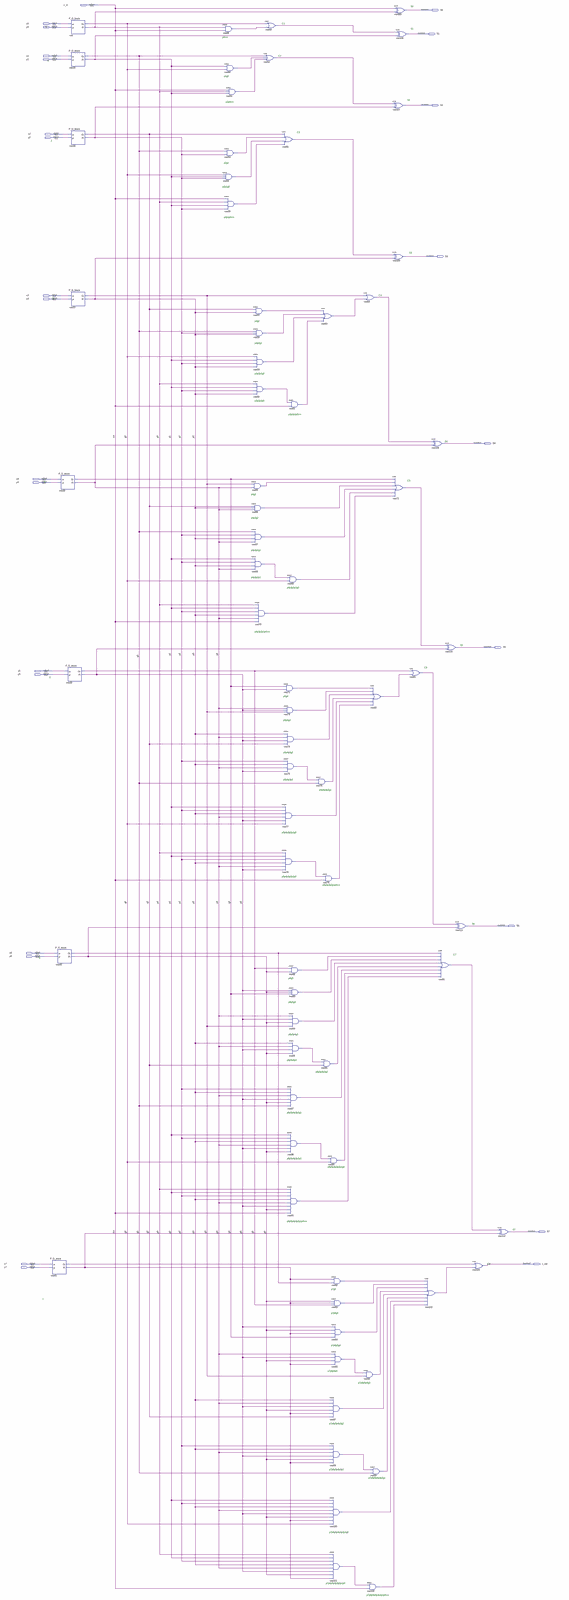
[diagram p0: schematic sheet, whole]
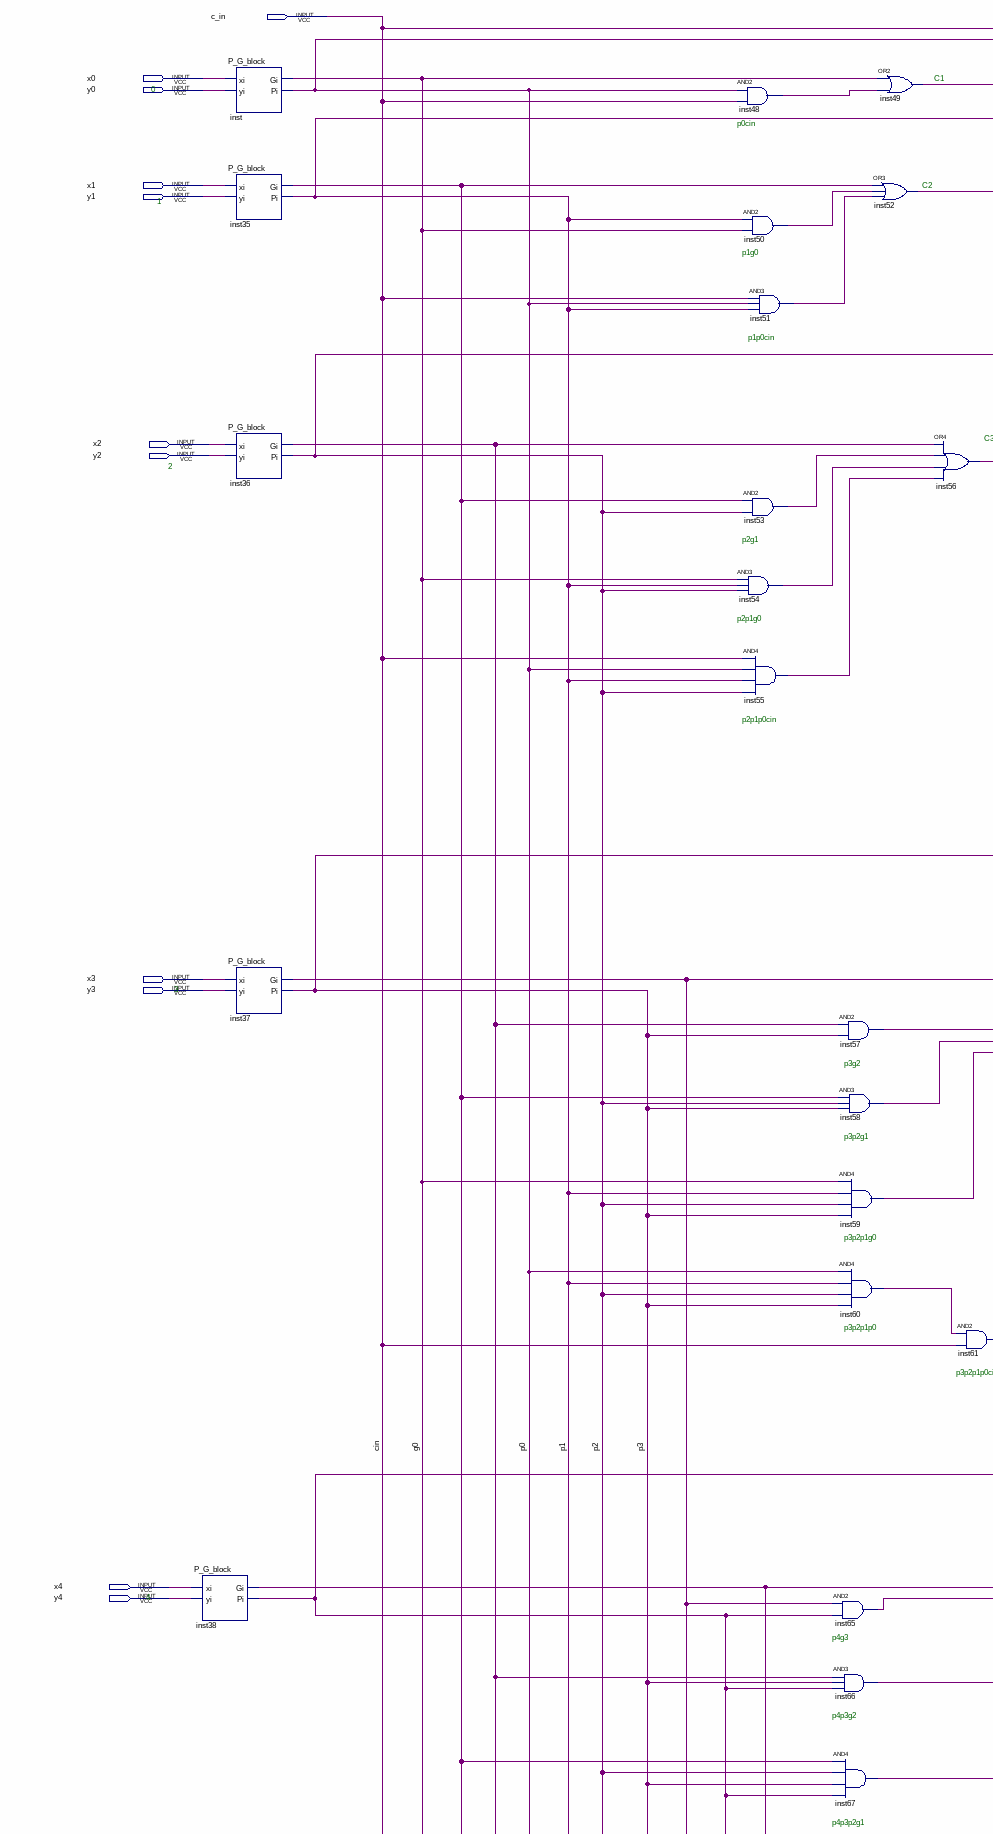
[diagram p1: schematic sheet, upper left part]
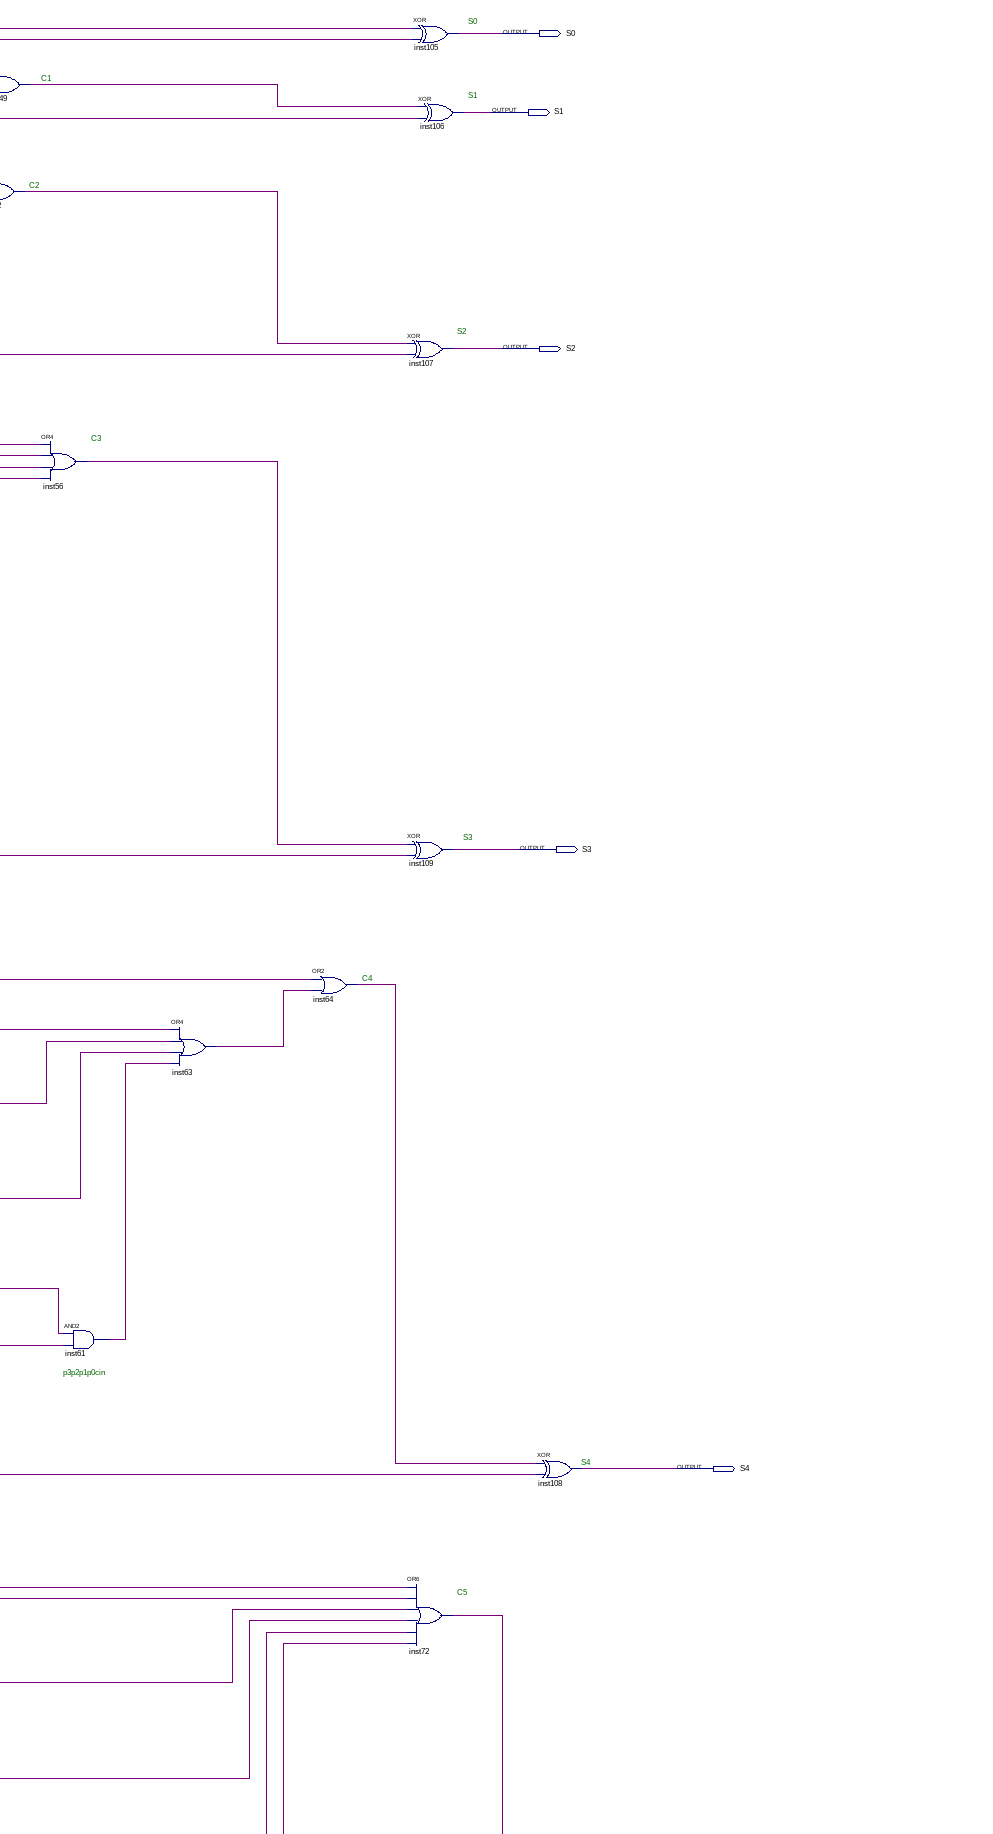
[diagram p2: schematic sheet, upper right part]
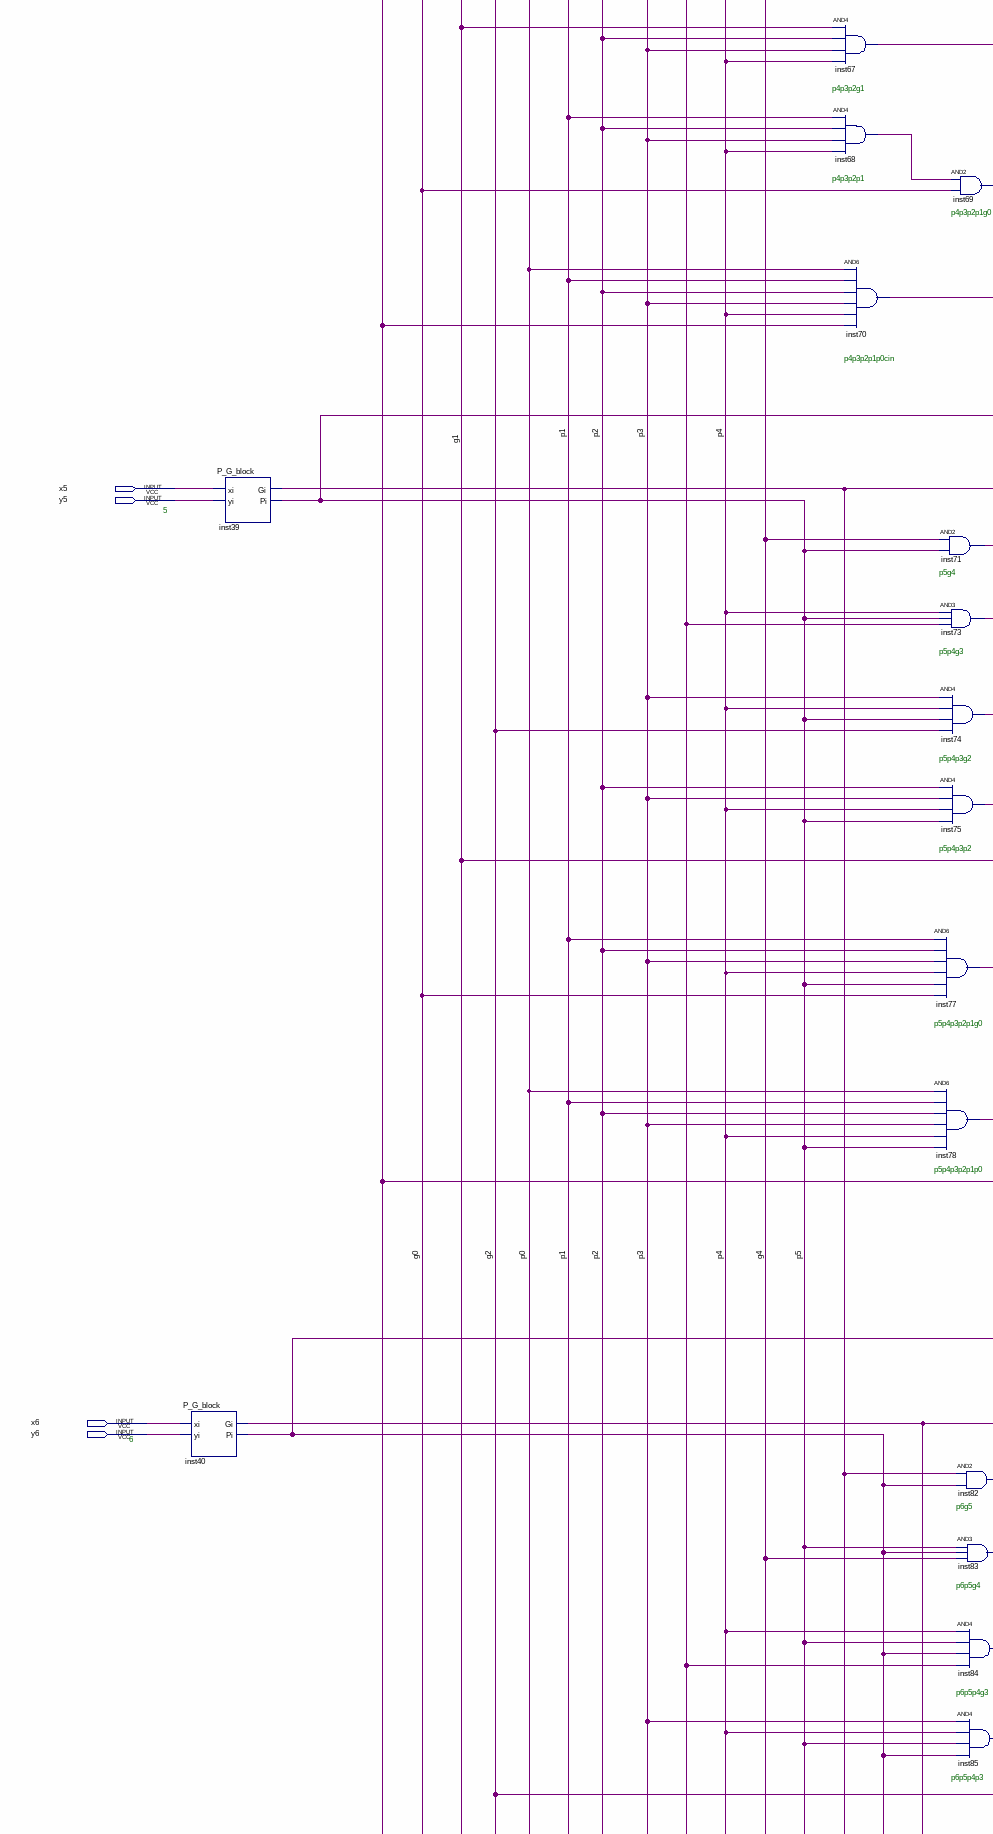
[diagram p3: schematic sheet, middle left part]
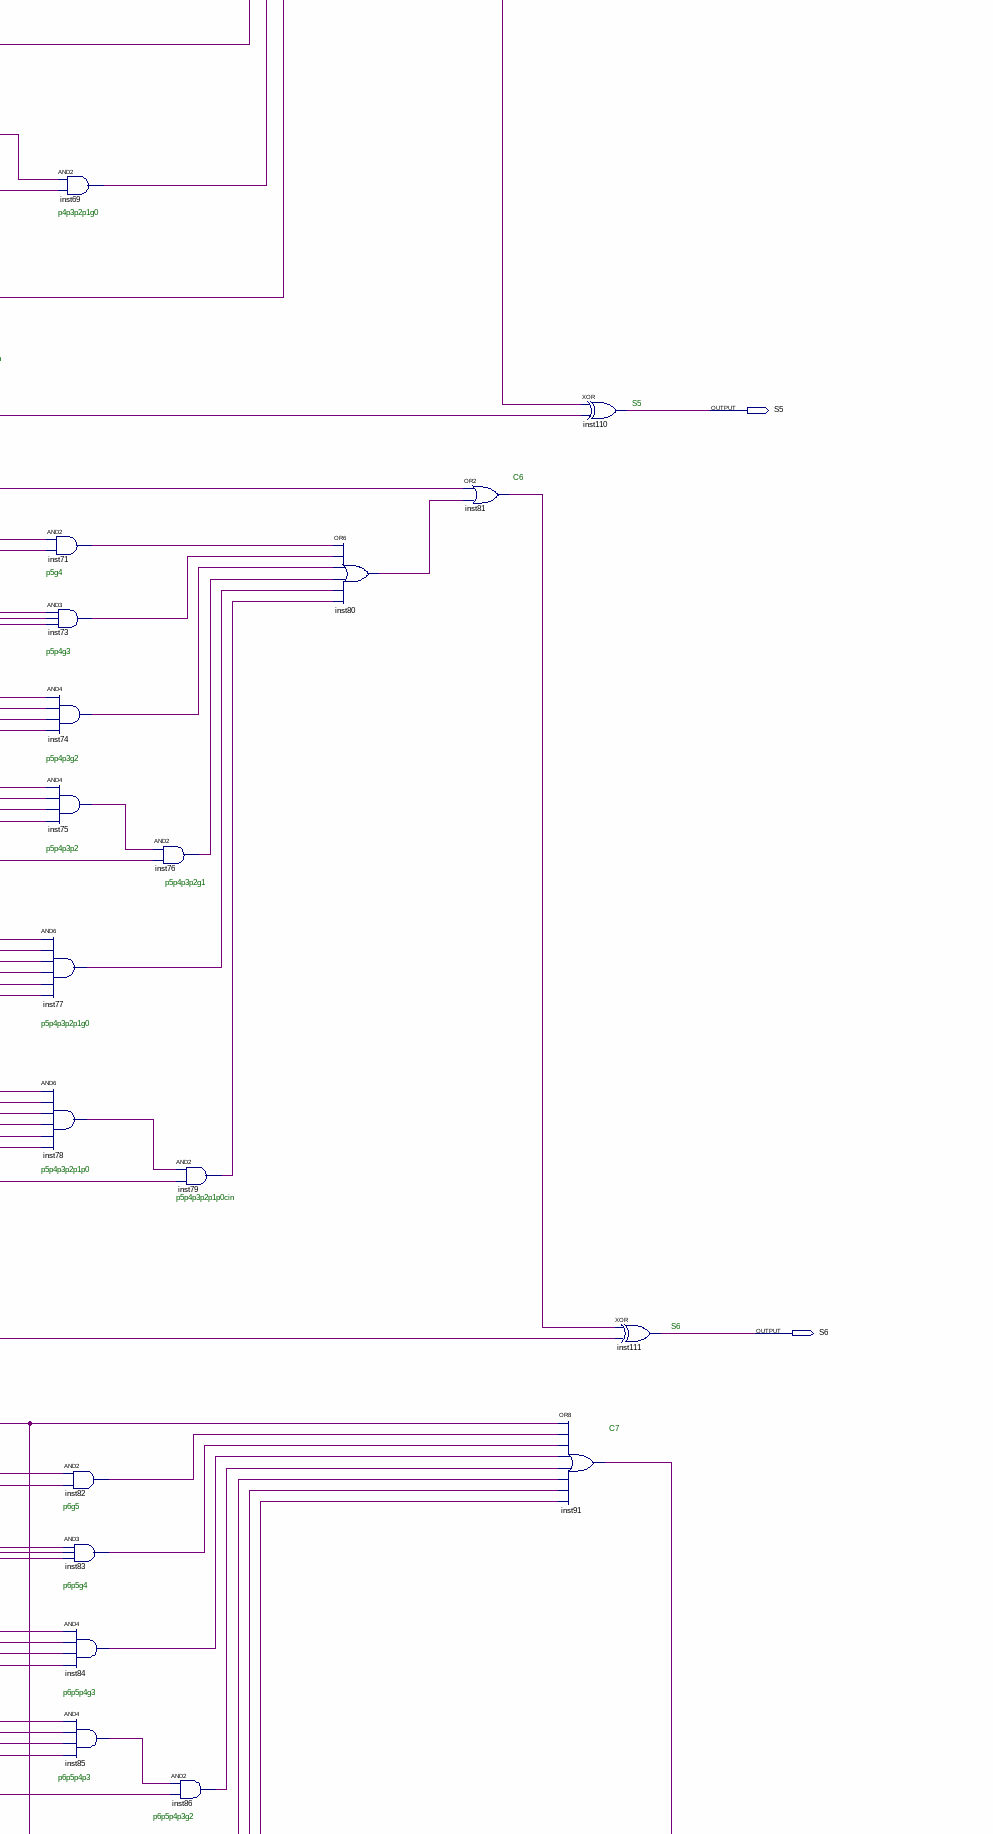
[diagram p4: schematic sheet, middle right part]
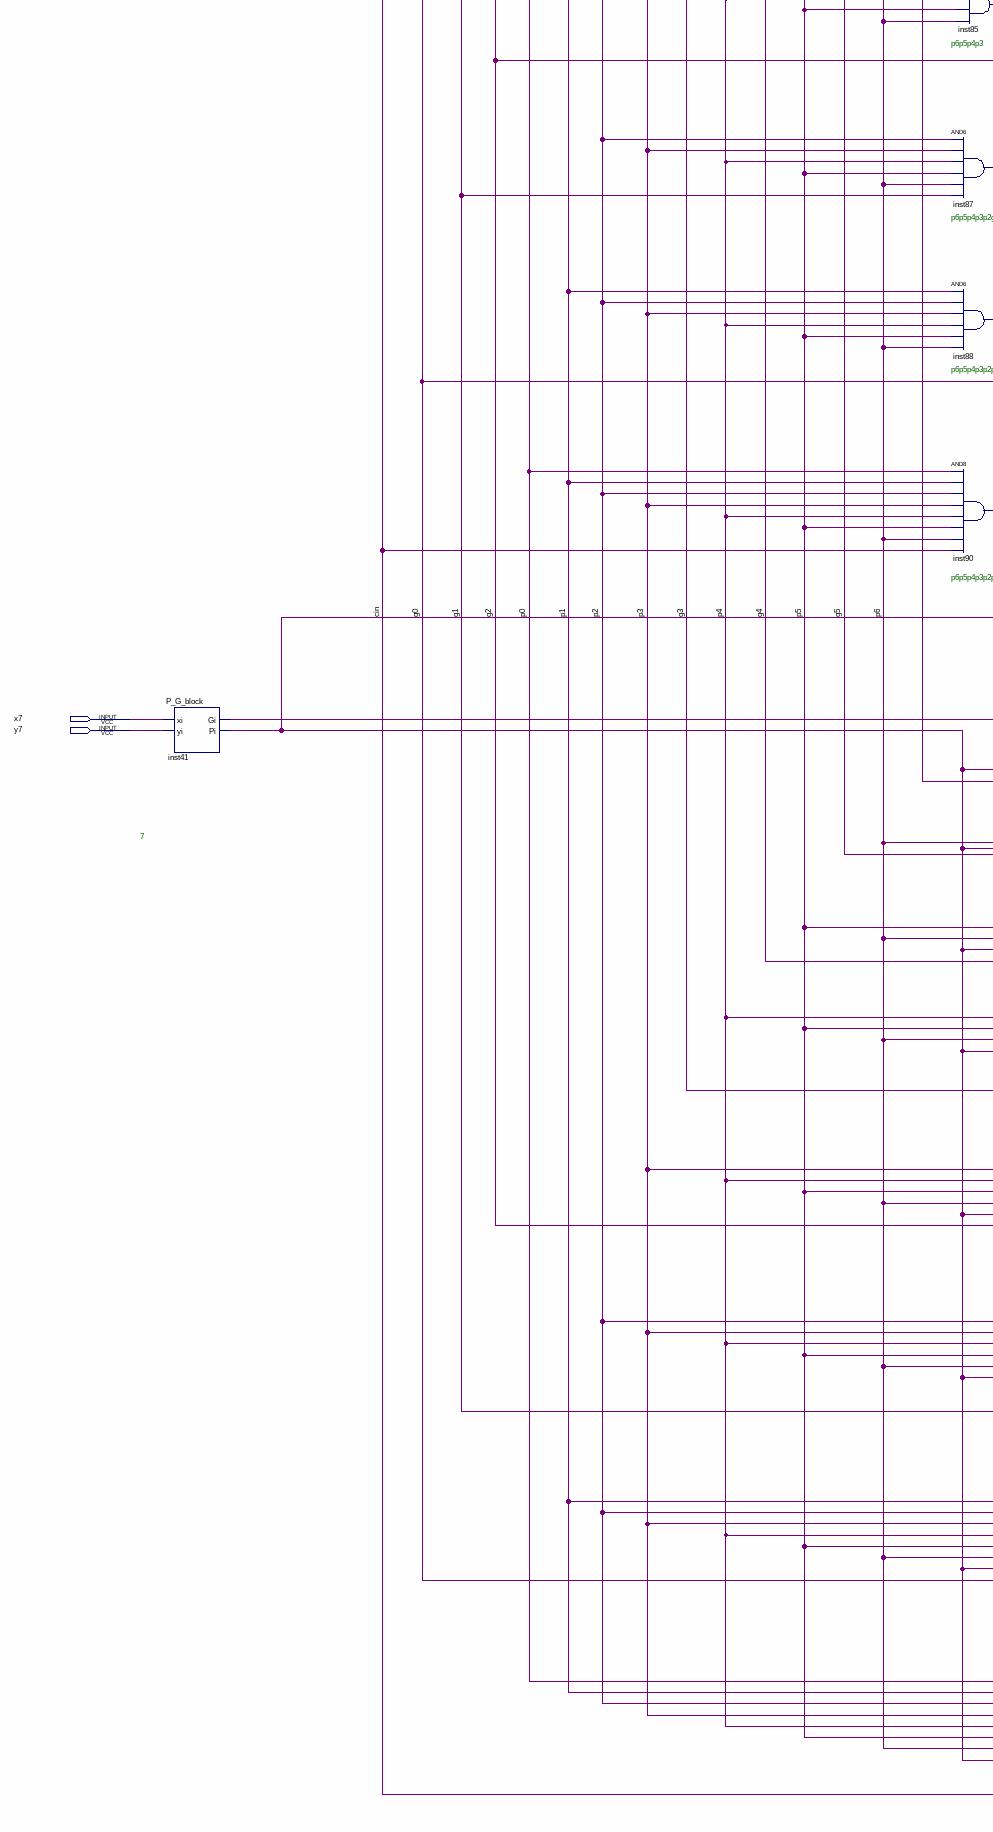
[diagram p5: schematic sheet, lower left part]
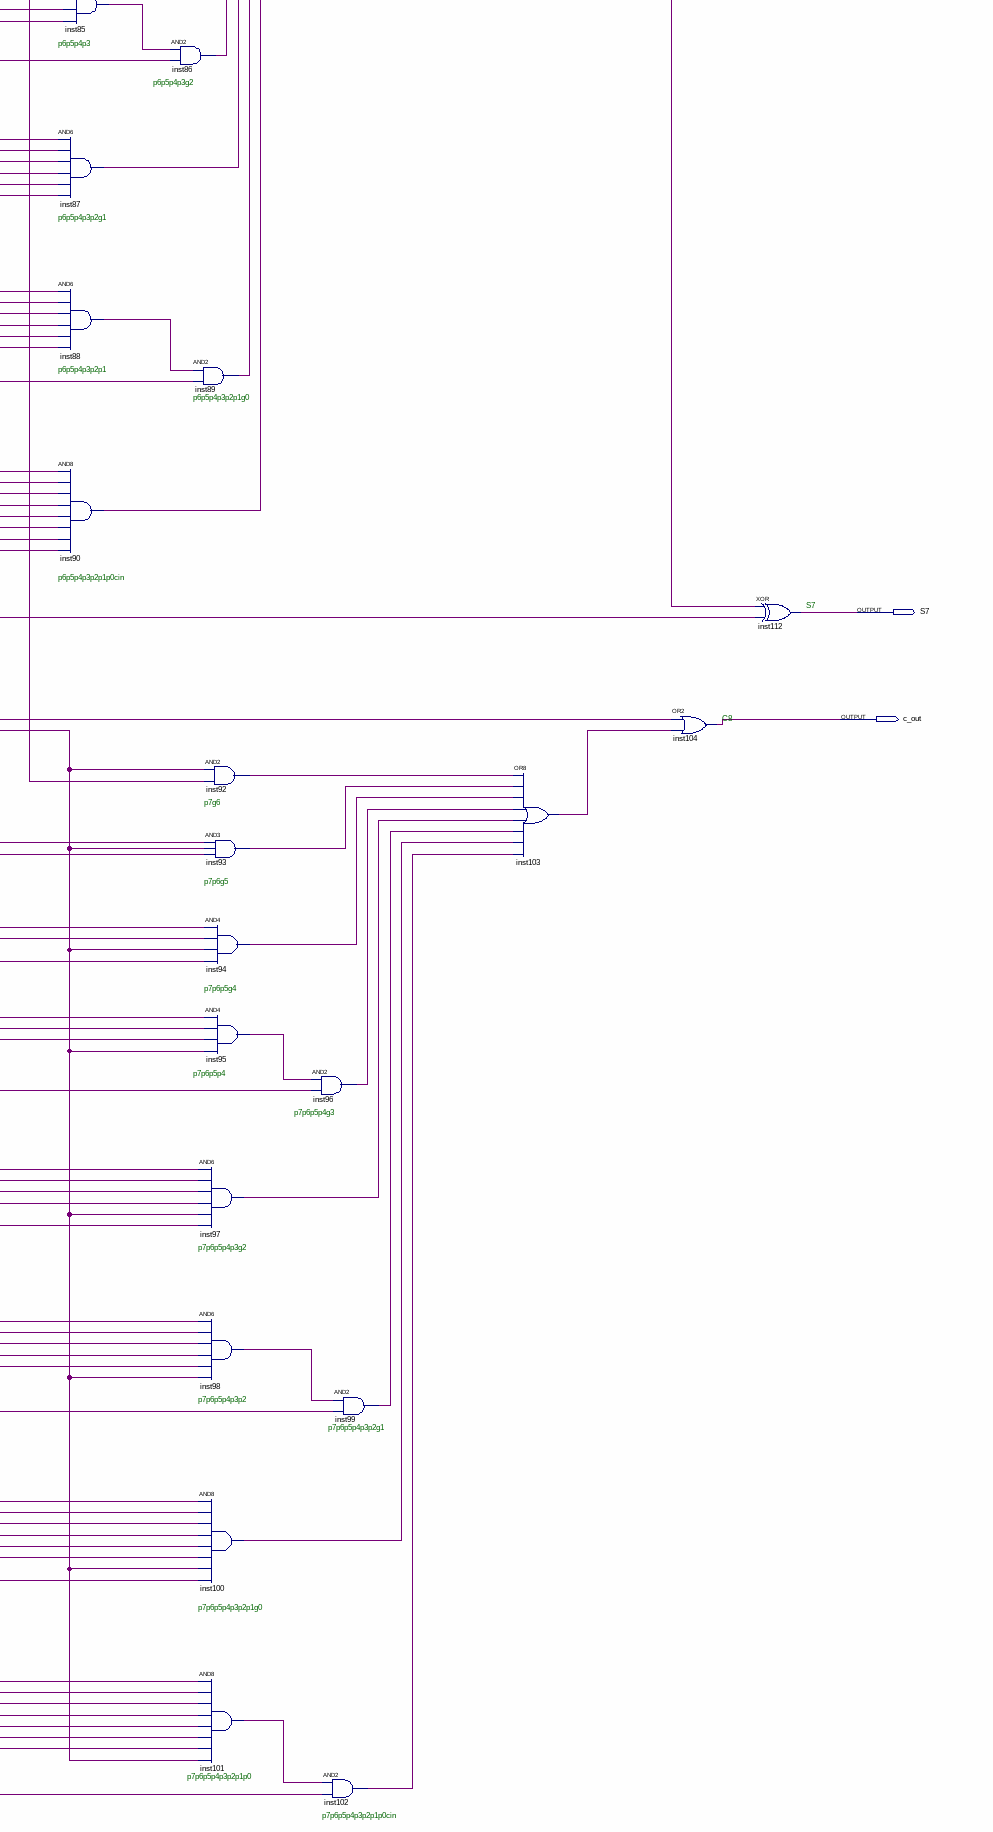
[diagram p6: schematic sheet, lower right part]
// Quartus schematic CLA_8inputs_updated.bdf as structural Verilog: 72 symbols, 26 pins
module CLA_8inputs_updated (
  input  c_in,
  input  x0,
  input  y0,
  input  x1,
  input  y1,
  input  x2,
  input  y2,
  input  x3,
  input  y3,
  input  x4,
  input  y4,
  input  x5,
  input  y5,
  input  x6,
  input  y6,
  input  x7,
  input  y7,
  output S0,
  output S1,
  output S2,
  output S3,
  output S4,
  output S5,
  output S6,
  output S7,
  output c_out
);

  wire g0, g1, g2, g3, g4, g5, inst40_gi, inst41_gi, inst41_pi, inst48_out, inst49_out, inst50_out,
       inst51_out, inst52_out, inst53_out, inst54_out, inst55_out, inst56_out, inst57_out, inst58_out,
       inst59_out, inst60_out, inst61_out, inst63_out, inst64_out, inst65_out, inst66_out, inst67_out,
       inst68_out, inst69_out, inst70_out, inst71_out, inst72_out, inst73_out, inst74_out, inst75_out,
       inst76_out, inst77_out, inst78_out, inst79_out, inst80_out, inst81_out, inst82_out, inst83_out,
       inst84_out, inst85_out, inst86_out, inst87_out, inst88_out, inst89_out, inst90_out, inst91_out,
       inst92_out, inst93_out, inst94_out, inst95_out, inst96_out, inst97_out, inst98_out, inst99_out,
       inst100_out, inst101_out, inst102_out, inst103_out, p0, p1, p2, p3, p4, p5, p6;

  P_G_block inst40 (.xi(x6), .yi(y6), .Gi(inst40_gi), .Pi(p6));
  P_G_block inst41 (.xi(x7), .yi(y7), .Gi(inst41_gi), .Pi(inst41_pi));
  P_G_block inst (.xi(x0), .yi(y0), .Gi(g0), .Pi(p0));
  P_G_block inst35 (.xi(x1), .yi(y1), .Gi(g1), .Pi(p1));
  P_G_block inst36 (.xi(x2), .yi(y2), .Gi(g2), .Pi(p2));
  P_G_block inst37 (.xi(x3), .yi(y3), .Gi(g3), .Pi(p3));
  P_G_block inst38 (.xi(x4), .yi(y4), .Gi(g4), .Pi(p4));
  P_G_block inst39 (.xi(x5), .yi(y5), .Gi(g5), .Pi(p5));
  and inst48 (inst48_out, p0, c_in);
  and inst50 (inst50_out, p1, g0);
  and inst51 (inst51_out, c_in, p0, p1);
  and inst53 (inst53_out, g1, p2);
  and inst54 (inst54_out, g0, p1, p2);
  and inst55 (inst55_out, c_in, p0, p1, p2);
  and inst57 (inst57_out, g2, p3);
  and inst58 (inst58_out, g1, p2, p3);
  and inst59 (inst59_out, g0, p1, p2, p3);
  and inst60 (inst60_out, p0, p1, p2, p3);
  and inst65 (inst65_out, g3, p4);
  and inst66 (inst66_out, g2, p3, p4);
  and inst67 (inst67_out, g1, p2, p3, p4);
  and inst68 (inst68_out, p1, p2, p3, p4);
  and inst70 (inst70_out, p0, p1, p2, p3, p4, c_in);
  or inst49 (inst49_out, g0, inst48_out);
  or inst52 (inst52_out, g1, inst50_out, inst51_out);
  or inst56 (inst56_out, g2, inst53_out, inst54_out, inst55_out);
  and inst71 (inst71_out, g4, p5);
  and inst73 (inst73_out, p4, p5, g3);
  and inst74 (inst74_out, p3, p4, p5, g2);
  and inst75 (inst75_out, p2, p3, p4, p5);
  and inst77 (inst77_out, p1, p2, p3, p4, p5, g0);
  and inst78 (inst78_out, p0, p1, p2, p3, p4, p5);
  and inst61 (inst61_out, inst60_out, c_in);
  and inst69 (inst69_out, inst68_out, g0);
  and inst82 (inst82_out, g5, p6);
  and inst83 (inst83_out, p5, p6, g4);
  and inst84 (inst84_out, p4, p5, p6, g3);
  and inst85 (inst85_out, p3, p4, p5, p6);
  and inst87 (inst87_out, p2, p3, p4, p5, p6, g1);
  and inst88 (inst88_out, p1, p2, p3, p4, p5, p6);
  and inst90 (inst90_out, p0, p1, p2, p3, p4, p5, p6, c_in);
  or inst63 (inst63_out, inst57_out, inst58_out, inst59_out, inst61_out);
  and inst76 (inst76_out, inst75_out, g1);
  and inst79 (inst79_out, inst78_out, c_in);
  and inst86 (inst86_out, inst85_out, g2);
  and inst89 (inst89_out, inst88_out, g0);
  and inst92 (inst92_out, inst41_pi, inst40_gi);
  and inst93 (inst93_out, p6, inst41_pi, g5);
  and inst94 (inst94_out, p5, p6, inst41_pi, g4);
  and inst95 (inst95_out, p4, p5, p6, inst41_pi);
  and inst97 (inst97_out, p3, p4, p5, p6, inst41_pi, g2);
  and inst98 (inst98_out, p2, p3, p4, p5, p6, inst41_pi);
  and inst100 (inst100_out, p1, p2, p3, p4, p5, p6, inst41_pi, g0);
  and inst101 (inst101_out, p0, p1, p2, p3, p4, p5, p6, inst41_pi);
  or inst64 (inst64_out, g3, inst63_out);
  and inst96 (inst96_out, inst95_out, g3);
  and inst102 (inst102_out, inst101_out, c_in);
  or inst80 (inst80_out, inst71_out, inst73_out, inst74_out, inst76_out, inst77_out, inst79_out);
  and inst99 (inst99_out, inst98_out, g1);
  xor inst105 (S0, c_in, p0);
  xor inst107 (S2, inst52_out, p2);
  xor inst109 (S3, inst56_out, p3);
  or inst72 (inst72_out, g4, inst65_out, inst66_out, inst67_out, inst69_out, inst70_out);
  xor inst106 (S1, inst49_out, p1);
  or inst81 (inst81_out, g5, inst80_out);
  xor inst108 (S4, inst64_out, p4);
  or inst103 (inst103_out, inst92_out, inst93_out, inst94_out, inst96_out, inst97_out, inst99_out, inst100_out, inst102_out);
  xor inst110 (S5, inst72_out, p5);
  or inst91 (inst91_out, inst40_gi, inst82_out, inst83_out, inst84_out, inst86_out, inst87_out, inst89_out, inst90_out);
  xor inst111 (S6, inst81_out, p6);
  or inst104 (c_out, inst41_gi, inst103_out);
  xor inst112 (S7, inst91_out, inst41_pi);

  // Other names for the same wires on the sheet: cin = c_in

  // Notes on the sheet:
  //   S0
  //   C1
  //   0
  //   S1
  //   p0cin
  //   C2
  //   1
  //   p1g0
  //   S2
  //   p1p0cin
  //   C3
  //   2
  //   p2g1
  //   p2p1g0
  //   p2p1p0cin
  //   S3
  //   C4
  //   3
  //   p3g2
  //   p3p2g1
  //   p3p2p1g0
  //   p3p2p1p0
  //   p3p2p1p0cin
  //   S4
  //   C5
  //   4
  //   p4g3
  //   p4p3g2
  //   p4p3p2g1
  //   p4p3p2p1
  //   p4p3p2p1g0
  //   p4p3p2p1p0cin
  //   S5
  //   C6
  //   5
  //   p5g4
  //   p5p4g3
  //   p5p4p3g2
  //   p5p4p3p2
  //   p5p4p3p2g1
  //   p5p4p3p2p1g0
  //   p5p4p3p2p1p0
  //   p5p4p3p2p1p0cin
  //   S6
  //   C7
  //   6
  //   p6g5
  //   p6p5g4
  //   p6p5p4g3
  //   p6p5p4p3
  //   p6p5p4p3g2
  //   p6p5p4p3p2g1
  //   p6p5p4p3p2p1
  //   p6p5p4p3p2p1g0
  //   p6p5p4p3p2p1p0cin
  //   S7
  //   C8
  //   p7g6
  //   7
  //   p7p6g5
  //   p7p6p5g4
  //   p7p6p5p4
  //   p7p6p5p4g3
  //   p7p6p5p4p3g2
  //   p7p6p5p4p3p2
  //   p7p6p5p4p3p2g1
  //   p7p6p5p4p3p2p1g0
  //   p7p6p5p4p3p2p1p0
  //   p7p6p5p4p3p2p1p0cin
endmodule
